# EAGLE schematic Servo-Driver v32 (EAGLE 9.7.0)
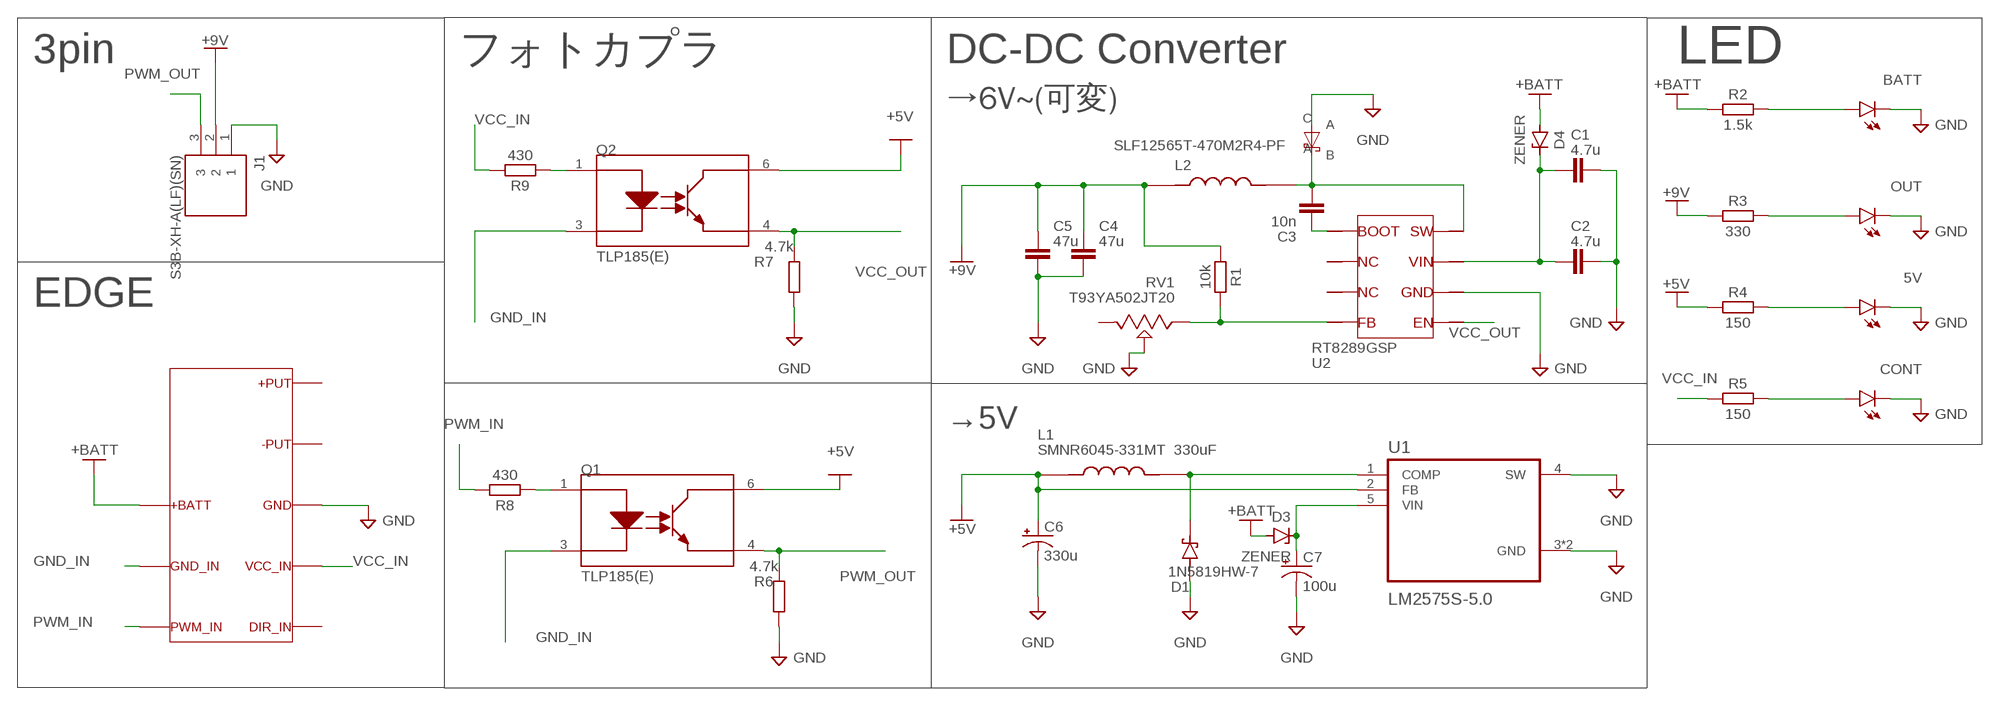
[diagram p0: schematic, sheet 1]

## Parts
5V  LED_CHIP_GREEN-1608  [LEDC1608X39N_G]
BATT  LED_CHIP_RED-1608  [LEDC1608X39N_R]
C1  4.7u  C_CHIP-1210(3225-METRIC)  [CAPC3225X135]
C2  4.7u  C_CHIP-1210(3225-METRIC)  [CAPC3225X135]
C3  10n  C_CHIP-0805(2012-METRIC)  [CAPC2012X110]
C4  47u  C_CHIP-1206(3216-METRIC)  [CAPC3216X135]
C5  47u  C_CHIP-1206(3216-METRIC)  [CAPC3216X135]
C6  330u  C-POL-US_ECAP-10.5MM  [CAPAE1030X1050N]
C7  100u  C-POL-US_ECAP-10.5MM  [CAPAE1030X1050N]
CONT  LED_CHIP_GREEN-1608  [LEDC1608X39N_G]
D1  1N5819HW-7  [SOD3715X145N]
D2  B550C  [DIO_B340-13-F]
D3  ZENER  ZENERDO-214AA(SMB)  [DIOM5336X265N]
D4  ZENER  ZENERDO-214AA(SMB)  [DIOM5336X265N]
EDGE1  10046971_019LF  [10046971-019LF]
J1  S3B-XH-A(LF)(SN)  [JST_S3B-XH-A(LF)(SN)]
L1  SMNR6045-331MT 330uF  VLS6045EX-331M  [IND_VLS6045EX-331M]
L2  SLF12565T-470M2R4-PF  [IND_SLF12565T-470M2R4-PF]
OUT  LED_CHIP_BLUE-1608  [LEDC1608X39N_B]
Q1  TLP185(E)  [SOIC254P700X230-4N]
Q2  TLP185(E)  [SOIC254P700X230-4N]
R1  10k  R_CHIP-0805(2012-METRIC)  [RESC2012X65]
R2  1.5k  R_CHIP-0603(1608-METRIC)  [RESC1608X60]
R3  330  R_CHIP-0603(1608-METRIC)  [RESC1608X60]
R4  150  R_CHIP-0603(1608-METRIC)  [RESC1608X60]
R5  150  R_CHIP-0603(1608-METRIC)  [RESC1608X60]
R6  4.7k  R_CHIP-0603(1608-METRIC)  [RESC1608X60]
R7  4.7k  R_CHIP-0603(1608-METRIC)  [RESC1608X60]
R8  430  R_CHIP-0603(1608-METRIC)  [RESC1608X60]
R9  430  R_CHIP-0603(1608-METRIC)  [RESC1608X60]
RV1  T93YA502JT20  PV36W502C01B00  [TRIM_PV36W502C01B00]
U1  LM2575S-5.0  [VREG_TPS79625KTTR]
U2  RT8289GSP  [SOIC127P599X175-9N]

## Nets
+5V: C6.1(+) L1.1 Q1.6(COLLECTOR) Q2.6(COLLECTOR) R4.1 U1.2(FB)
+9V: C4.1 C5.1 J1.2 L2.1 R1.1 R3.1
+BATT: D3.2(A) D4.2(A) EDGE1.P$12(+BATT) EDGE1.P$13(+BATT) EDGE1.P$14(+BATT) EDGE1.P$15(+BATT) EDGE1.P$16(+BATT) EDGE1.P$17(+BATT) EDGE1.P$18(+BATT) EDGE1.P$19(+BATT) EDGE1.P$20(+BATT) EDGE1.P$21(+BATT) EDGE1.P$22(+BATT) EDGE1.P$23(+BATT) R2.1
GND: 5V.1(C) BATT.1(C) C1.2 C2.2 C4.2 C5.2 C6.2(-) C7.2(-) CONT.1(C) D1.A D2.C(A) EDGE1.P$28(GND) EDGE1.P$29(GND) EDGE1.P$30(GND) EDGE1.P$31(GND) EDGE1.P$32(GND) EDGE1.P$33(GND) EDGE1.P$34(GND) EDGE1.P$35(GND) EDGE1.P$36(GND) EDGE1.P$37(GND) EDGE1.P$38(GND) EDGE1.P$39(GND) J1.1 OUT.1(C) R6.2 R7.2 RV1.2 U1.3(GND) U1.4(SW) U1.6(GND) U2.6(GND) U2.9(GND)
GND_IN: EDGE1.P$24(GND_IN) Q1.3(CATHODE) Q2.3(CATHODE)
N$1: CONT.2(A) R5.2
N$2: Q2.1(ANODE) R9.1
N$3: 5V.2(A) R4.2
N$4: C3.1 U2.1(BOOT)
N$5: BATT.2(A) R2.2
N$6: D1.C(K) L1.2 U1.1(COMP)
N$7: R1.2 RV1.1 U2.4(FB)
N$8: C3.2 D2.A(B) L2.2 U2.8(SW)
N$9: OUT.2(A) R3.2
N$10: Q1.1(ANODE) R8.1
N$12: C7.1(+) D3.1(C) U1.5(VIN)
N$13: C1.1 C2.1 D4.1(C) U2.7(VIN)
PWM_IN: EDGE1.P$25(PWM_IN) R8.2
PWM_OUT: J1.3 Q1.4(EMITTER) R6.1
VCC_IN: EDGE1.P$27(VCC_IN) R5.1 R9.2
VCC_OUT: Q2.4(EMITTER) R7.1 U2.5(EN)
Unconnected: EDGE1.P$1(+PUT) EDGE1.P$2(+PUT) EDGE1.P$3(+PUT) EDGE1.P$4(+PUT) EDGE1.P$5(+PUT) EDGE1.P$6(-PUT) EDGE1.P$7(-PUT) EDGE1.P$8(-PUT) EDGE1.P$9(-PUT) EDGE1.P$10(-PUT) EDGE1.P$11(-PUT) EDGE1.P$26(DIR_IN) EDGE1.P$40(-PUT) EDGE1.P$41(-PUT) EDGE1.P$42(-PUT) EDGE1.P$43(-PUT) EDGE1.P$44(-PUT) EDGE1.P$45(+PUT) EDGE1.P$46(+PUT) EDGE1.P$47(+PUT) EDGE1.P$48(+PUT) EDGE1.P$49(+PUT) EDGE1.P$50(+PUT) RV1.3 U2.2(NC1) U2.3(NC2)

## Notes on the sheet
- 3pin | フォトカプラ | DC-DC Converter | LED
- →6V~(可変)
- EDGE
- →5V

## Library data of the parts
5V CONT = Tutorial - Fusion 360:LED_CHIP: LED - Generic; CATEGORY: Opto-Electronic; COLOR: Green; SUB-CATEGORY: LED
BATT = Tutorial - Fusion 360:LED_CHIP: LED - Generic; CATEGORY: Opto-Electronic; COLOR: Red; SUB-CATEGORY: LED
C1 C2 C4 C5 = Capacitor:C: Capacitor - Generic; CATEGORY: Capacitor
C3 = Tutorial - Fusion 360:C: Capacitor - Generic; CATEGORY: Capacitor
C6 C7 = Capacitor:C-POL-US: Capacitor Polarised - ANSI; CATEGORY: Capacitor
D1 = 1N5819HW-7:1N5819HW-7: 1N5819HW Series 40 V 1 A Surface Mount Schottky Barrier Rectifier - SOD-123 Check availability <https://pricing.snapeda.com/parts/1N5819HW-7/Diodes%20Inc./view-part?ref=eda>; AVAILABILITY: In Stock; CHECK_PRICES: https://www.snapeda.com/parts/1N5819HW-7/Diodes+Inc./view-part/?ref=eda; DESCRIPTION: Diode Schottky 40 V 1A Surface Mount SOD-123; MF: Diodes Inc.; MP: 1N5819HW-7; PACKAGE: SOD-123 Fairchild Semiconductor; PRICE: None; PURCHASE-URL: https://www.snapeda.com/api/url_track_click_mouser/?unipart_id=51510&manufacturer=Diodes Inc.&part_name=1N5819HW-7&search_term=1n5819; SNAPEDA_LINK: https://www.snapeda.com/parts/1N5819HW-7/Diodes+Inc./view-part/?ref=snap
D2 = B550C-13-F (1):B550C
D3 D4 = Diode:ZENER: Zener Diode - Generic; CATEGORY: Diode; SUB-CATEGORY: Zener
EDGE1 = driveunit:10046971_019LF
J1 = S3B-XH-A_LF__SN_:S3B-XH-A(LF)(SN): Connector Header Through Hole, Right Angle 3 position 0.098" (2.50mm) Check availability <https://pricing.snapeda.com/parts/S3B-XH-A%28LF%29%28SN%29/JST%20Sales%20America%20Inc./view-part?ref=eda>; AVAILABILITY: In Stock; CHECK_PRICES: https://www.snapeda.com/parts/S3B-XH-A(LF)(SN)/JST+Sales+America+Inc./view-part/?ref=eda; DESCRIPTION: Connector Header Through Hole, Right Angle 3 position 0.098 (2.50mm); MF: JST Sales America Inc.; MP: S3B-XH-A(LF)(SN); PACKAGE: Custom Package JST Sales; PRICE: None; SNAPEDA_LINK: https://www.snapeda.com/parts/S3B-XH-A(LF)(SN)/JST+Sales+America+Inc./view-part/?ref=snap
L1 = VLS6045EX-331M:VLS6045EX-331M: Check availability <https://pricing.snapeda.com/parts/VLS6045EX-331M/TDK%20Corporation/view-part?ref=eda>; AVAILABILITY: Not in stock; CHECK_PRICES: https://www.snapeda.com/parts/VLS6045EX-331M/TDK/view-part/?ref=eda; DESCRIPTION: 330 µH Shielded Drum Core, Wirewound Inductor 470 mA 1.44Ohm Nonstandard; MF: TDK Corporation; MP: VLS6045EX-331M; PACKAGE: NON STANDARD-2 TDK; PRICE: None; PURCHASE-URL: https://www.snapeda.com/api/url_track_click_mouser/?unipart_id=3218107&manufacturer=TDK Corporation&part_name=VLS6045EX-331M&search_term=inductor 330; SNAPEDA_LINK: https://www.snapeda.com/parts/VLS6045EX-331M/TDK/view-part/?ref=snap
L2 = SLF12565T-470M2R4-PF:SLF12565T-470M2R4-PF: Check availability <https://pricing.snapeda.com/parts/SLF12565T-470M2R4-PF/TDK/view-part?ref=eda>; AVAILABILITY: In Stock; CHECK_PRICES: https://www.snapeda.com/parts/SLF12565T-470M2R4-PF/TDK/view-part/?ref=eda; DESCRIPTION: 47 µH Shielded Drum Core, Wirewound Inductor 2.8 A 69.4mOhm Max Nonstandard; MF: TDK; MP: SLF12565T-470M2R4-PF; PACKAGE: NON STANDARD-2 TDK; PRICE: None; PURCHASE-URL: https://www.snapeda.com/api/url_track_click_mouser/?unipart_id=1503656&manufacturer=TDK&part_name=SLF12565T-470M2R4-PF&search_term=slf12565t-470m2r4-pf; SNAPEDA_LINK: https://www.snapeda.com/parts/SLF12565T-470M2R4-PF/TDK/view-part/?ref=snap
OUT = Tutorial - Fusion 360:LED_CHIP: LED - Generic; CATEGORY: Opto-Electronic; COLOR: Blue; SUB-CATEGORY: LED
Q1 Q2 = TLP185_E_:TLP185(E): Optocoupler DC-IN 1-CH Transistor DC-OUT 4-Pin SO Check availability <https://pricing.snapeda.com/parts/TLP185%28E%29/Toshiba/view-part?ref=eda>; AVAILABILITY: In Stock; CHECK_PRICES: https://www.snapeda.com/parts/TLP185(E)/Toshiba+Semiconductor+and+Storage/view-part/?ref=eda; DESCRIPTION: Optoisolator Transistor Output 3750Vrms 1 Channel 6-SO, 4 Lead; MF: Toshiba; MP: TLP185(E); PACKAGE: SO-6 Toshiba; PRICE: None; SNAPEDA_LINK: https://www.snapeda.com/parts/TLP185(E)/Toshiba+Semiconductor+and+Storage/view-part/?ref=snap
R1-R9 = Resistor:R: Resistor Fixed - Generic; CATEGORY: Resistor; SUB-CATEGORY: Fixed
RV1 = PV36W502C01B00:PV36W502C01B00: Check availability <https://pricing.snapeda.com/parts/PV36W502C01B00/Bourns/view-part?ref=eda>; AVAILABILITY: In Stock; CHECK_PRICES: https://www.snapeda.com/parts/PV36W502C01B00/Bourns/view-part/?ref=eda; DESCRIPTION: 5 kOhms 0.5W, 1/2W PC Pins Through Hole Trimmer Potentiometer Cermet 25.0 Turn Top Adjustment; MF: Bourns; MP: PV36W502C01B00; PACKAGE: PV36W Bourns; PRICE: None; SNAPEDA_LINK: https://www.snapeda.com/parts/PV36W502C01B00/Bourns/view-part/?ref=snap
U1 = LM2575S-5.0:LM2575S-5.0: Check availability <https://pricing.snapeda.com/parts/LM2575S-5.0/Texas%20Instruments/view-part?ref=eda>; AVAILABILITY: In Stock; CHECK_PRICES: https://www.snapeda.com/parts/LM2575S-5.0/Texas+Instruments/view-part/?ref=eda; DESCRIPTION: SIMPLE SWITCHER 1A Step-Down Voltage Regulator 5-DDPAK/TO-263 -40 to 125; MF: Texas Instruments; MP: LM2575S-5.0; PACKAGE: TO-263-5 Texas Instruments; PRICE: None; SNAPEDA_LINK: https://www.snapeda.com/parts/LM2575S-5.0/Texas+Instruments/view-part/?ref=snap
U2 = RT8289GSP (2):RT8289GSP